# Altium schematic sheet audio amplifier.SchDoc
size A; SheetNumber: 1; SheetTotal: 1
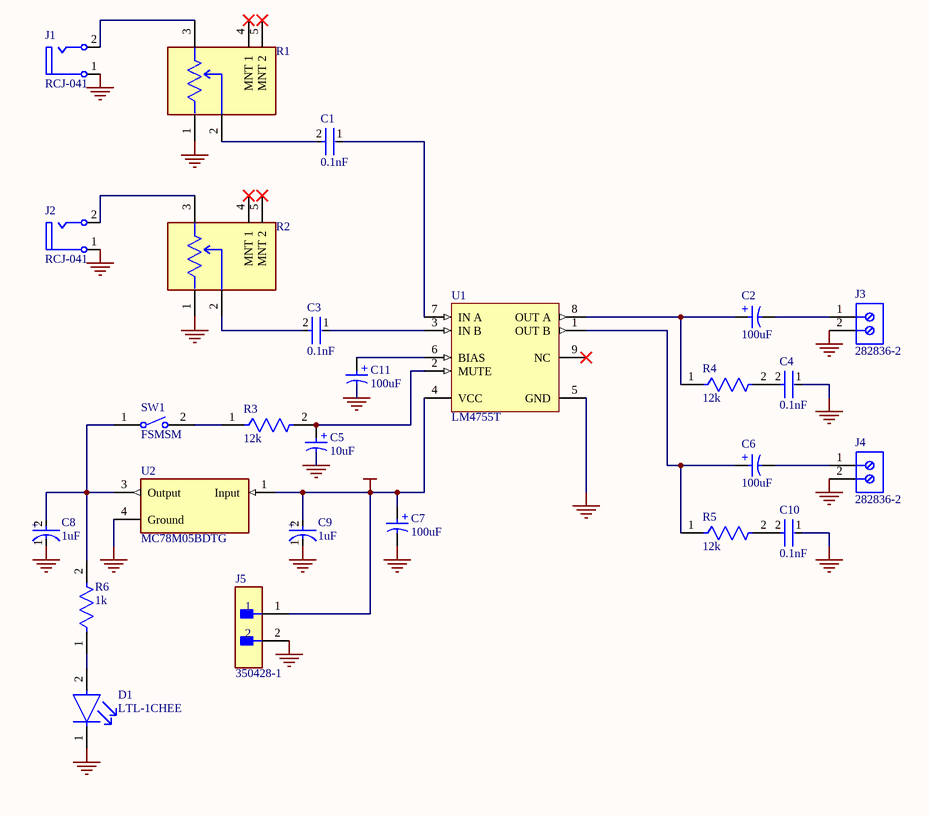
[diagram p0: audio amplifier.SchDoc]

## Parts
C1  0.1nF  [FP-562R5GAS10-MFG]
C2  100uF  [WCAP-ATLL_D8H11.5]
C3  0.1nF  [FP-562R5GAS10-MFG]
C4  0.1nF  [FP-562R5GAS10-MFG]
C5  10uF  [WCAP-ATLL_D8H11.5]
C6  100uF  [WCAP-ATLL_D8H11.5]
C7  100uF  [WCAP-ATLL_D8H11.5]
C8  1uF  [FP-RAD-TH-D_16_0_5-L_25_2-MFG]
C9  1uF  [FP-RAD-TH-D_16_0_5-L_25_2-MFG]
C10  0.1nF  [FP-562R5GAS10-MFG]
C11  100uF  [WCAP-ATLL_D8H11.5]
D1  LTL-1CHEE  [FP-LTL-1CHEE-MFG]
J1  RCJ-041  [CUI-RCJ-041_V]
J2  RCJ-041  [CUI-RCJ-041_V]
J3  282836-2  [TECO-282836-2_V]
J4  282836-2  [TECO-282836-2_V]
J5  350428-1  [FP-350428-1-MFG]
R1  PTV09A-4225F-B103  [FP-PTV09A-4-MFG]  (value not drawn)
R2  PTV09A-4225F-B103  [FP-PTV09A-4-MFG]  (value not drawn)
R3  12k  [FP-CF14-MFG]
R4  12k  [FP-CF14-MFG]
R5  12k  [FP-CF14-MFG]
R6  1k  [FP-CF14-MFG]
SW1  FSMSM  [TECO-FSMSM-2_V]
U1  LM4755T  [TA09A]
U2  MC78M05BDTG  [FP-369C-MFG]

## Nets
GND: C4.1 C5.2(N) C7.2(N) C8.1(C) C9.1(C) C10.1 C11.2(N) D1.1(C) J1.1 J2.1 J3.2 J4.2 J5.2 R1.1 R2.1 U1.5(GND) U2.4(Ground)
VCC: C7.1(P) C9.2(A) J5.1 U1.4(VCC) U2.1(Input)
NetC1_1: C1.1 U1.7(IN_A)
NetC1_2: C1.2 R1.2
NetC2_1: C2.1(P) R4.1 U1.8(OUT_A)
NetC2_2: C2.2(N) J3.1
NetC3_1: C3.1 U1.3(IN_B)
NetC3_2: C3.2 R2.2
NetC4_2: C4.2 R4.2
NetC5_1: C5.1(P) R3.2 U1.2(MUTE)
NetC6_1: C6.1(P) R5.1 U1.1(OUT_B)
NetC6_2: C6.2(N) J4.1
NetC8_2: C8.2(A) R6.2 SW1.1 U2.3(Output)
NetC10_2: C10.2 R5.2
NetC11_1: C11.1(P) U1.6(BIAS)
NetD1_2: D1.2(A) R6.1
NetJ1_2: J1.2 R1.3
NetJ2_2: J2.2 R2.3
NetR3_1: R3.1 SW1.2

Not connected (* = marked no-connect by the designer): R1 4(MNT_1)* 5(MNT_2)*; R2 4(MNT_1)* 5(MNT_2)*; U1 9(NC)*

## Notes on the sheet
- (in symbol CMP-03913-53914461-1) +
- (in symbol CMP-05427-001116-1) +

## Library data of the parts
C1 C3 C4 C10 = CMP-02417-000061-1: CAP CER 10000PF 1KV Z5U RADIAL; Dissipation Factor: 2.5%; Tolerance: 20%; Lead Length: 29mm; Lead Diameter: 0.64mm; Lead/Base Style: Straight; Application(s): GENERAL PURPOSE; Capacitance: 10nF; Voltage Rating: 1kV; Voltage Rating (DC): 1kV; Depth: 4mm; Package Quantity: 250; Case/Package: Radial; Radiation Hardening: No; Diameter: 12.4mm; Dielectric: Z5U; Series: Cera-Mite 562R; Height: 0.25inch; Length: 2inch; Resistor Type: Ceramic; Width: 4mm; Contact Plating: Tin; Height - Seated (Max): 0.613inch; Packaging: Bulk; Lead Free: Lead Free; Construction: RADIAL; Mount: Through Hole; RoHS Compliant: Yes; Termination: Radial; Min Operating Temperature: -55°C; Lead Pitch: 9.5mm; Weight: 0.01lb; Max Operating Temperature: 105°C; Voltage: 1kV
C2 C5-C7 C11 = CMP-03913-53914461-1: 860160574013 WCAP-ATLL Aluminum Electrolytic Capacitors; Pitch: 3.5mm; Ripple Current: 414mA; Voltage Rating (DC): 35V; Tolerance: 20%; Life (Hours): 7000hours; Capacitance: 100µF; Material: Aluminium; Leakage Current: 35µA; Length: 11.5mm; Case/Package: Radial; Min Operating Temperature: -55°C; Max Operating Temperature: 105°C; REACH SVHC: Unknown; NexarPartId: 53914461; Height: 11.5mm; RoHS: Non-Compliant; Diameter: 8mm; Voltage Rating: 35V; Lead Pitch: 3.5mm
C8 C9 = CMP-05427-001116-1: Aluminum Electrolytic Capacitors (Radial Lead Type) 47uF ±20% 400V; Ripple Current (AC): 1.18A; Dissipation Factor: 0.24%; Dielectric Material: Aluminium; Life (Hours): 10000Hour; Lead Diameter: 0.8mm; Leakage Current: 1.138mA; Mount: Through Hole; Diameter: 16mm; Number of Pins: 2; Capacitance: 47uF; Package Quantity: 100; Voltage: 400V; Voltage Rating (DC): 400V; Max Operating Temperature: 105°C; Termination: Radial; Case/Package: Radial; Lead Free: Lead Free; Construction: RADIAL; Lead Pitch: 7.5mm; Series: EE; Tolerance: 20%; Length: 25mm; RoHS Compliant: Yes; Ripple Current: 1.18A; Height - Seated (Max): 0.984inch; Radiation Hardening: No; Height: 25mm; Voltage Rating: 400V; Packaging: Bulk; Min Operating Temperature: -25°C; REACH SVHC: No SVHC
D1 = CMP-22017-000040-1: LED RED CLEAR T/H; Viewing Angle: 45°; Power Dissipation: 100mW; Wavelength: 635nm; Number of LEDs: 1; Test Current: 10mA; Lens Style: Dome; Forward Current: 30mA; Forward Voltage: 2V; Luminous Intensity: 19mcd; Reverse Voltage: 5V; Dominant Wavelength: 625nm; RoHS Compliant: Yes; Mount: Through Hole; Diameter: 3.1mm; Package Quantity: 1000; Lens Transparency: Clear; Illumination Color: Red; Lens Color: Red; Max Operating Temperature: 100°C; Radiation Hardening: No; Case/Package: T; Width: 3.8mm; Length: 3.8mm; Depth: 3.8mm; Series: -; Number of Pins: 2; Number of Elements: 1; Height: 5.2mm; Max Power Dissipation: 100mW; Lead Free: Lead Free; Packaging: Bulk; Color: Red; Min Operating Temperature: -55°C
J1 J2 = CMP-1692-00002-1: Female RCJ Jack, 2 Position, Height 11.724 mm, Tail Length 4 mm, RoHS, Bulk; Case\Package: Metal; Connector Type: HDMI; Current Rating: 500 mA; Voltage Rating: 40 V; Length: 16.2 mm; Pins: 19; ComponentLink1URL: http://www.cui.com/; ComponentLink1Description: Manufacturer URL; Packaging: Tape and Reel; Lead Pitch: 0.5 mm; PackageDescription: Female RCJ Jack, 2 Position, Height 11.724 mm, Tail Length 4 mm; RoHSCompliant: true; Min Operating Temperature: -55 degC; Height: 6.1 mm; Contact Material: Copper; REACH SVHC: No SVHC; DatasheetVersion: Rev. B, 02/2012; ComponentLink2Description: Datasheet; Contact Plating: Gold; Colour: Black; Max Operating Temperature: 85 degC; Mount: Surface Mount; Package Quantity: 400; Gender: Female; ComponentLink2URL: http://www.cui.com/product/resource/rcj-04x.pdf; PackageReference: RCJ-041
J3 J4 = CMP-1684-00017-1: Female Header, Pitch 5 mm, 1 x 2 Position, Height 10 mm, Tail Length 3.5 mm, Rohs, Bulk; Manufacturer: TE Connectivity; Wire Gauge: 16-30AWG; Product Training Modules: Wire-to-BoardEurostyleTerminalBlocks; Clamp Material - Plating: Brass-NickelPlated; Voltage: 300V; Mating Orientation: HorizontalwithBoard; Current: 13.5A; Pitch: 0.197"(5.00mm); Screw Thread: M3; 3D Model: 282836-2.pdf; Other Names: 5ULV-02B / A98076; Dynamic Catalog: BuchananSeries; Number of Levels: 1; Torque - Screw: 0.68Nm(6Lb-In); Featured Product: EurostyleTerminalBlockConnectors; Positions Per Level: 2; Wire Termination: Screw-RisingCageClamp; Datasheet URL: http://www.te.com.cn/commerce/DocumentDelivery/DDEController?Action=showdoc&DocId=Catalog+Section%7F1308389_EUROSTYLE_TERMINAL_BLOCKS%7F0607%7Fpdf%7FEnglish%7FENG_CS_1308389_EUROSTYLE_TERMINAL_BLOCKS_0607.pdf%7F282836-2; Color: Green; Family: TerminalBlocks-WiretoBoard; RoHS Information: 282836-2StatementofCompliance; Standard Package: 300; Contact Material - Plating: Brass-TinPlated; Manufacturer URL: http://www.te.com; Housing Material: Polyamide(PA66),Nylon6/6; Features: Interlocking(Side); Package Description: Female Header, Pitch 5 mm, 1 x 2 Position, Height 10 mm, Tail Length 3.5 mm; Mounting Type: ThroughHole; Package Reference: THD; Packaging: Bulk; Series: Buchanan; Category: Connectors,Interconnects; Screw Material - Plating: Brass-NickelPlated
J5 = CMP-03369-000080-1: CONN HEADER VERT 2POS 6.35MM; Manufacturer: TE Connectivity; Standoff Height: 0.63mm; Number Of Contacts: 2; Conn Gender: Male; Voltage Rating: 600V; Conn Orientation: Vertical; Current Rating: 12A; Number Of Rows: 1; Mouser Description: Connector, Soft Shell; Universal MATE-N-LOK; 2; Nylon; Natural; 19 A; 600 VAC; Height: 14.99mm; Pitch: 6.35mm; ComponentLink2URL: https://www.te.com/commerce/DocumentDelivery/DDEController?Action=showdoc&DocId=Customer+Drawing%7F350428%7FY2%7Fpdf%7FEnglish%7FENG_CD_350428_Y2.pdf%7F350428-1; Device Class L1: Connectors; Automotive: No; Octopart: https://octopart.com/350428-1-te+connectivity-46505355; Digikey Description: CONN HEADER VERT 2POS 6.35MM; RoHS: TRUE; Temperature: -40°C to +105°C; Contact Material: Gold,Nickel; Package: 350428-1; Temperature Range Low: -40°C; Device Class L3: unset; Lead Free: Yes; Device Class L2: Headers and Wire Housings; Category: Conn; ComponentLink2Description: Datasheet; Temperature Range High: +105°C; Manufacturer Part Number: 350428-1
R1 R2 = CMP-07234-000052-1: POT 10K OHM 1/20W CARBON LINEAR; Power Rating: 50mW; Number of Gangs: 1; Hole Diameter: 9.1mm; Actuator Diameter: 0.236inch; Resistance Tolerance: 20%; Resistance: 10kR; Actuator Length: 0.984inch; Min Operating Temperature: -10°C; RoHS Compliant: Yes; Technology: CARBON FILM; Radiation Hardening: No; Taper: Linear; Military Standard: Not; Type: Potentiometer; Mount: Through Hole; Length: 11.4mm; Tolerance: 20%; Max Power Dissipation: 50mW; Max Operating Temperature: 50°C; Package Quantity: 100; Termination: PCB; Packaging: Bulk; Depth: 12.5mm; Resistor Type: Carbon; Number of Turns: 1; Series: Pro Audio PTV09; Height: 12.5mm; REACH SVHC: No SVHC
R3-R6 = CMP-26528-000003-1: RES 7.5K OHM 1/4W 5% AXIAL; Max Power Dissipation: 250mW; Temperature Coefficient: -400ppm/°C; Resistance: 7.5kR; RoHS Compliant: Yes; Lead Free: Lead Free; Max Operating Temperature: 155°C; Case/Package: Axial; Tolerance: 5%; Power Rating: 250mW; Diameter: 2.3mm; Features: Flame Retardant Coating; Series: CF; Resistor Type: Carbon Film; Number of Terminations: 2; Length: 0.256inch; Min Operating Temperature: -55°C; Contact Plating: Tin; Packaging: Tape and Reel; Mount: Through Hole; Radiation Hardening: No
SW1 = CMP-2000-07511-1: FSMSM Push Button Switch, 50 mA, -35 to 85 degC, 2-Pin SMD, RoHS, Bulk; Manufacturer: TE Connectivity; Actuator Length: 1.07mm; Electrical Life: 20000Cycles; Actuator Material: Polyamide; Current Rating: 50mA; Illumination Type: Illuminated; Voltage Rating (DC): 24V; Contact Resistance: 100mOhm; Case\/Package: SMD/SMT; Operating Force: 180gf; Switch Travel: 0.25mm; Max Voltage Rating (DC): 12V; Throw Configuration: SPST; Packaging: LoosePiece; Max Operating Temperature: 85degC; ELV: Compliant; Package Description: 2-Pin Surface Mount Device, Body 6 x 3.5 mm, Pitch 9.19 mm; RoHSCompliant: true; Manufacturer URL: http://www.te.com/; Contact Plating: Silver; Contact Material: Brass; Mounting Technology: SurfaceMount; Contact Current Rating: 50mA; Datasheet Version: Rev. C2, 08/2014; Datasheet URL: http://www.te.com/commerce/DocumentDelivery/DDEController?Action=showdoc&DocId=Customer+Drawing%7F1437566-3%7FC2%7Fpdf%7FEnglish%7FENG_CD_1437566-3_C2_1437566_3_1_c.dwg.pdf%7F1437566-3; Mechanical Life: 20000Cycles; Package Reference: FSMSM; REACH SVHC: Unknown; Orientation: Straight; Min Operating Temperature: -35degC; Lead Free: LeadFree; Termination: GullWing; Package Quantity: 1000; Mount: SurfaceMount
U1 = CMP-0057-00640-1: Stereo 11W Audio Power Amplifier with Mute, 9-pin TO-220; Manufacturer: National Semiconductor; PowerWise: N; CompType: Audio IC; PackageTopMarking: NSUZXYTTE#*LM4755T; RoHS: N; PinCount: 9; PackageReference: TA09A; PackageDescription: TO-220, Molded, 9 Lead, Staggered; PackageVersion: revC, Jul-1999; DatasheetVersion: May-2008
U2 = CMP-07128-000029-1: IC REG LINEAR 5V 500MA DPAK; Manufacturer: ON Semiconductor; Accuracy Percentage: 4%; Standoff Height: 0mm; Dropout Voltage: 2V; Output Type: Fixed; Nominal Supply Current: 3.2mA; Number Of Outputs: 1; Min Supply Voltage: 7V; Max Supply Voltage: 35V; Max Junction Temp: +125°C; Octopart: https://octopart.com/mc78m05bdtg-on+semiconductor-1009693; Device Class L1: Integrated Circuits (ICs); Lead Free: Yes; RoHS: TRUE; Package: 369C; ComponentLink2Description: Datasheet; Footprint Url: https://www.onsemi.com/pub/Collateral/369C.PDF; Mouser Description: Linear Voltage Regulators 5V 500mA Positive; Temperature: -40°C to +125°C; Device Class L3: Voltage Regulators - Linear; ComponentLink2URL: https://www.onsemi.cn/PowerSolutions/document/MC78M00-D.PDF; Digikey Description: IC REG LINEAR 5V 500MA DPAK; Manufacturer Part Number: MC78M05BDTG; Automotive: No; Temperature Range Low: -40°C; Output Current: 500mA; Temperature Range High: +125°C; Height: 2.51mm; Category: IC; Device Class L2: Power Management ICs; Output Voltage: 5V